# EasyEDA Pro project ax08.eprj, schematic frontpanel_v2
Board Name: frontpanel_v2; Create Date: 2025-09-23; Page Name: frontpanel_v2; Project Name: ax08; Schematic Name: frontpanel_v2; Update Date: 2025-09-24; Company: EasyEDA.com; Page Size: A4; Version: V1.0
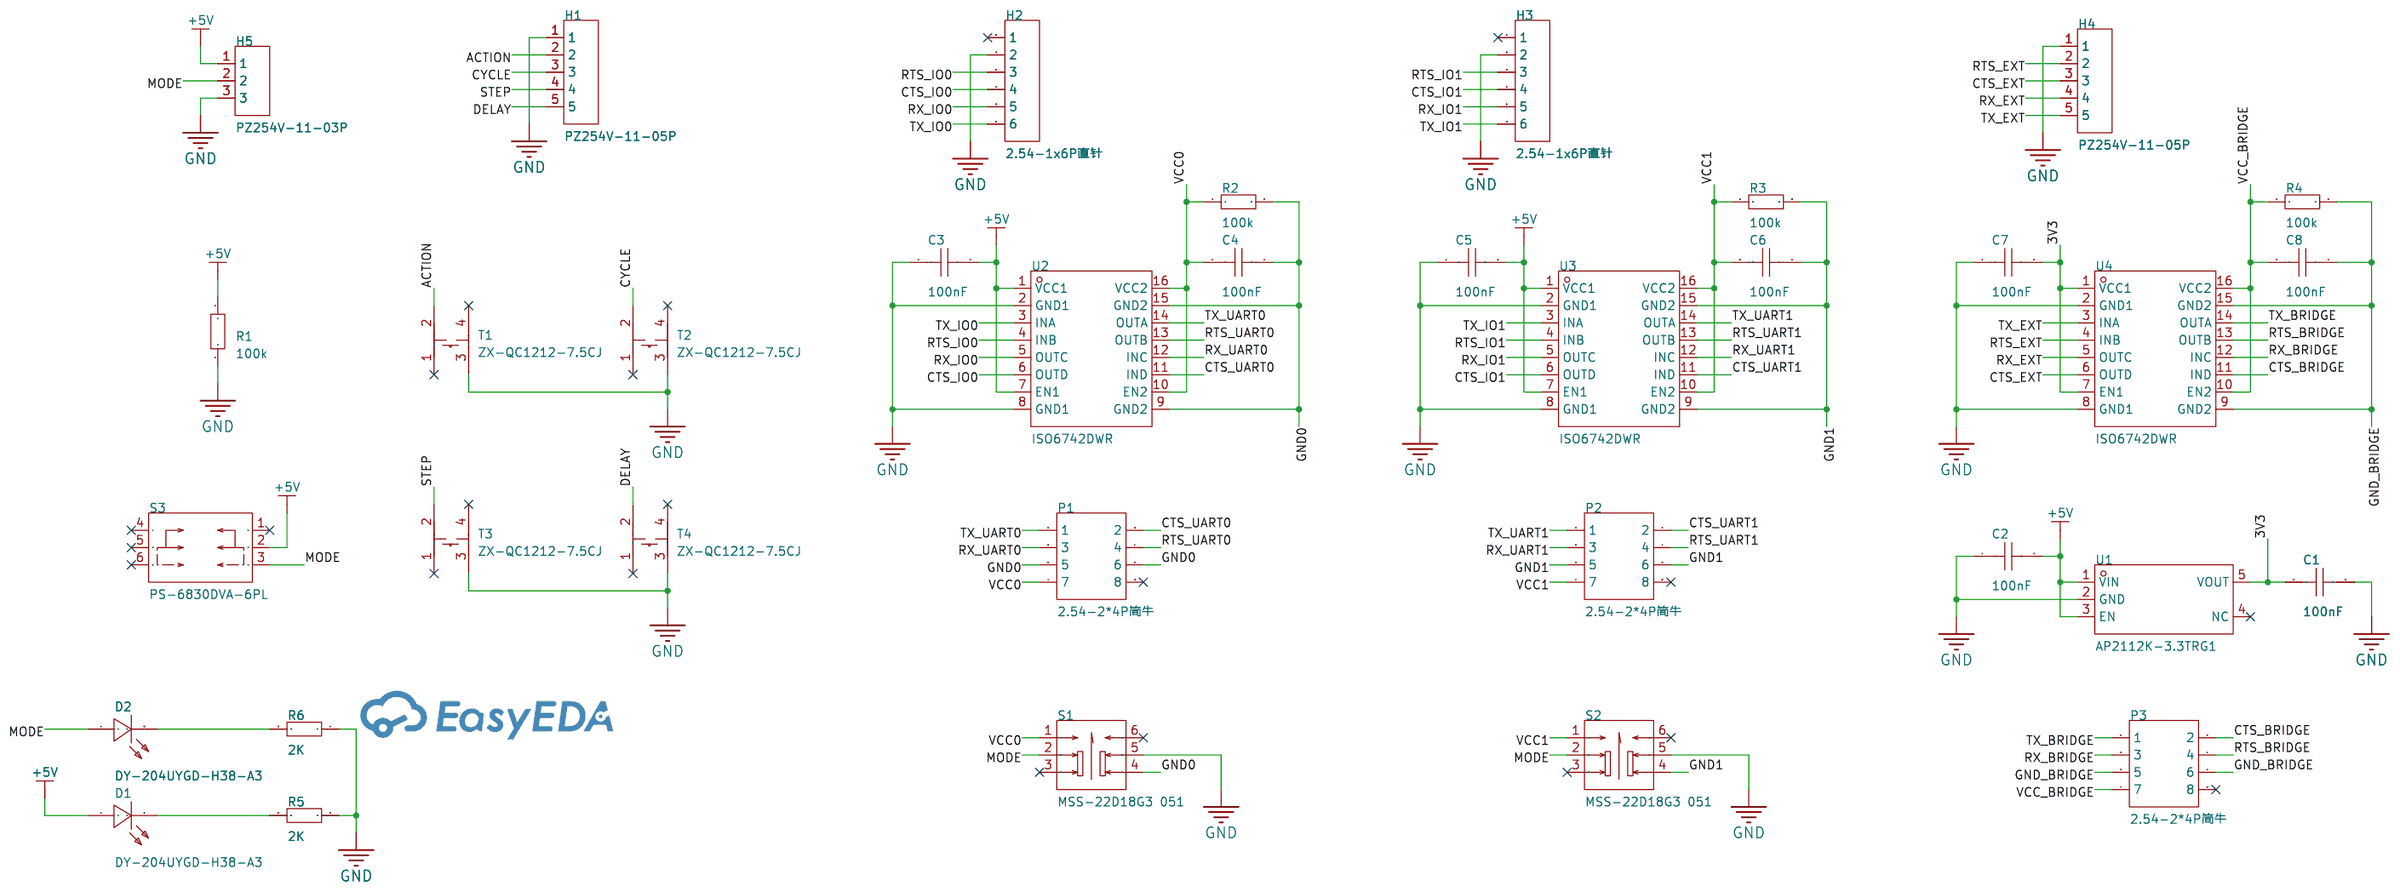
[diagram p38: schematic sheet]

## Parts
C1  100nF  [C0805]
C2  100nF  [C0805]
C3  100nF  [C0805]
C4  100nF  [C0805]
C5  100nF  [C0805]
C6  100nF  [C0805]
C7  100nF  [C0805]
C8  100nF  [C0805]
D1  DY-204UYGD-H38-A3  [LED-TH_BD4.0-P2.54-FD]
D2  DY-204UYGD-H38-A3  [LED-TH_BD4.0-P2.54-FD]
H1  PZ254V-11-05P  [HDR-TH_5P-P2.54-V-M]
H2  2.54-1x6P直针  [HDR-TH_6P-P2.54-V-M-1]
H3  2.54-1x6P直针  [HDR-TH_6P-P2.54-V-M-1]
H4  PZ254V-11-05P  [HDR-TH_5P-P2.54-V-M]
H5  PZ254V-11-03P  [HDR-TH_3P-P2.54-V-M]
P1  2.54-2*4P简牛  [IDC-TH_8P-P2.54-V-R2-C4-S2.54]
P2  2.54-2*4P简牛  [IDC-TH_8P-P2.54-V-R2-C4-S2.54]
P3  2.54-2*4P简牛  [IDC-TH_8P-P2.54-V-R2-C4-S2.54]
R1  100k  [R0805_1]
R2  100k  [R0805_1]
R3  100k  [R0805_1]
R4  100k  [R0805_1]
R5  2K  [R0805_1]
R6  2K  [R0805_1]
S1  MSS-22D18G3 051  [SW-TH_MSS-22D18G3-051]
S2  MSS-22D18G3 051  [SW-TH_MSS-22D18G3-051]
S3  PS-6830DVA-6PL  [SW-TH_6P-L6.4-W6.4-P2.00-LS4.5_PS-6830DVA-6PN]
T1  ZX-QC1212-7.5CJ  [KEY-TH_4P-L12.0-W12.0-P5.00-LS12.5]
T2  ZX-QC1212-7.5CJ  [KEY-TH_4P-L12.0-W12.0-P5.00-LS12.5]
T3  ZX-QC1212-7.5CJ  [KEY-TH_4P-L12.0-W12.0-P5.00-LS12.5]
T4  ZX-QC1212-7.5CJ  [KEY-TH_4P-L12.0-W12.0-P5.00-LS12.5]
U1  AP2112K-3.3TRG1  [SOT-25-5_L2.9-W1.6-P0.95-LS2.8-BL]
U2  ISO6742DWR  [SOIC-16_L10.3-W7.4-P1.27-LS10.3-BL]
U3  ISO6742DWR  [SOIC-16_L10.3-W7.4-P1.27-LS10.3-BL]
U4  ISO6742DWR  [SOIC-16_L10.3-W7.4-P1.27-LS10.3-BL]

## Library data of the parts
C1-C8 = CC0805KRX7R9BB104: Capacitance: Tolerance:±10% Tolerance:±10% Voltage Rated: Temperature Coefficient:; LCSC Part Name: 100nF ±10% 50V; Supplier Part: C49678; Manufacturer: YAGEO(国巨); Supplier Footprint: 0805; JLCPCB Part Class: Basic Part; Datasheet: https://atta.szlcsc.com/upload/public/pdf/source/20180224/C181747_15194369449651363981.pdf; Supplier: LCSC; Tolerance: ±10%
D1 D2 = DY-204UYGD-H38-A3: LCSC Part Name: 3mm圆头有边黄绿色; Supplier Part: C7470727; Manufacturer: TONYU(东裕); Supplier Footprint: D=3mm; JLCPCB Part Class: Extended Part; Datasheet: https://atta.szlcsc.com/upload/public/pdf/source/20230726/000EB079CD0A8C169FA94F7B667CD1E2.pdf; Supplier: LCSC
H1 H4 = PZ254V-11-05P: LCSC Part Name: 1x5P 间距:2.54mm 方针 直插; Supplier Part: C492404; Manufacturer: XFCN(兴飞); Supplier Footprint: 插件,P=2.54mm; JLCPCB Part Class: Extended Part; Datasheet: https://atta.szlcsc.com/upload/public/pdf/source/20200309/C492404_E51533260F8710EFF5D4617281164C1D.pdf; Supplier: LCSC; Pin Structure: 1x5P; Pitch: 2.54mm; Circluar Pins/Square Pins: Policy; Mounting Type: Straight; Number of Rows: Single Row; Number of Pins: 5P; Length of Mating Pin: 6mm; Insulation Height: 2.5mm; Length of End Connection Pin: 3mm; Contact Material: Brass; Operating Temperature: -40℃~+105℃; Color: Black
H2 H3 = 2.54-1x6P直针: LCSC Part Name: 1x6P 间距:2.54mm 方针 直插; Supplier Part: C37208; Manufacturer: BOOMELE(博穆精密); Supplier Footprint: 插件,P=2.54mm; JLCPCB Part Class: Extended Part; Datasheet: https://atta.szlcsc.com/upload/public/pdf/source/20250115/42A019761A40C8B839643401D8CA5A96.pdf; Supplier: LCSC; Pin Structure: 1x6P; Pitch: 2.54mm; Circluar Pins/Square Pins: Policy; Mounting Type: Straight; Number of Rows: Single Row; Number of Pins: 6P; Current Rating: 3A; Contact Material: Brass; Operating Temperature: -40℃~+105℃; Color: Black
H5 = PZ254V-11-03P: LCSC Part Name: 1x3P 间距:2.54mm 方针 直插; Supplier Part: C2937625; Manufacturer: XFCN(兴飞); Supplier Footprint: 插件,P=2.54mm; JLCPCB Part Class: Extended Part; Datasheet: https://atta.szlcsc.com/upload/public/pdf/source/20200309/C492402_8335C3D49C4E4C618838D59BB1D024C1.pdf; Supplier: LCSC; Pin Structure: 1x3P; Pitch: 2.54mm; Circluar Pins/Square Pins: Policy; Mounting Type: Straight; Number of Rows: Single Row; Number of Pins: 3P; Current Rating: 3A; Voltage Rating (Max): 250V; Length of Mating Pin: 6mm; Insulation Height: 2.5mm; Length of End Connection Pin: 3mm; Operating Temperature: -40℃~+105℃; Color: Black
P1-P3 = 2.54-2*4P简牛: LCSC Part Name: 2.54mm 2x4P 排数:2 每排P数:4; Supplier Part: C9135; Manufacturer: BOOMELE(博穆精密); Supplier Footprint: 插件,P=2.54mm; JLCPCB Part Class: Extended Part; Datasheet: https://item.szlcsc.com/datasheet/2.54-2*4P%25E7%25AE%2580%25E7%2589%259B/9658.html; Supplier: LCSC; Connector Type: IDC Header; Pitch: 2.54mm; Number of Positions or Pins: 2x4P; Holder Type: Through Hole; Row Spacing: 2.54mm; Number of Rows: 2; Number of PINs Per Row: 4
R1-R6 = Res_0603: Supplier Footprint: 0603
S1 S2 = MSS-22D18G3 051: LCSC Part Name: 两档立式插件 6脚拨动 柄长3MM; Supplier Part: C7507430; Manufacturer: SHOU HAN(首韩); Supplier Footprint: DIP; JLCPCB Part Class: Extended Part; Datasheet: https://item.szlcsc.com/datasheet/MSS-22D18G3%2520051/8598452.html; Supplier: LCSC; Circuit: DPDT; Actuator Style: Rectangular Columnar; Termination Style: PC Pin; Mounting Type: Through Hole; Current Rating: 100mA; Voltage Rating: 12V; Life: 10,000 Cycles; Operating Temperature: -10℃~+50℃
S3 = PS-6830DVA-6PL: LCSC Part Name: 平头自锁,行程1.0mm,按动力180gf,带防水帽,IP65; Supplier Part: C5155620; Manufacturer: G-Switch(品赞); Supplier Footprint: 插件; JLCPCB Part Class: Extended Part; Datasheet: https://item.szlcsc.com/datasheet/PS-6830DVA-6PL/5785373.html; Supplier: LCSC; Self Lock / No Lock: Latching; Actuator Style: Rectangular Plunger; Contact Current: 500mA; Voltage Rating: 24V; Actuator/Cap Color: White; With Lamp: Without; Operating Force: 1.8N; Operating Temperature: -40℃~+85℃; Life: 30,000 Cycles
T1-T4 = ZX-QC1212-7.5CJ: LCSC Part Name: 12*12*7.5插件; Supplier Part: C7470190; Manufacturer: Megastar(兆星); Supplier Footprint: DIP; JLCPCB Part Class: Extended Part; Datasheet: https://atta.szlcsc.com/upload/public/pdf/source/20230724/4B47FF3F78A9A93D44388AE7A727BAE5.pdf; Supplier: LCSC; Circuit: SPST; Actuator Style: Round Button; Operating Force: 260gf; Mounting Style: Direct Insert; Switch Length: 12mm; Switch Width: 12mm; Switch Height: 7.5mm; Strike Gundam: Without bracket; Contact Current: 50mA; Voltage Rating: 12V; Actuator/Cap Color: Black; Pin Style: PCPin; Mechanical Life: 100000 Times; Operating Temperature: -30℃~+80℃
U1 = AP2112K-3.3TRG1: LCSC Part Name: 输入6V 输出3.3V 600mA; Supplier Part: C51118; Manufacturer: DIODES(美台); Supplier Footprint: SOT-25-5; JLCPCB Part Class: Extended Part; Datasheet: https://item.szlcsc.com/datasheet/AP2112K-3.3TRG1/52131.html; Supplier: LCSC; Output Type: Fixed; Voltage - Supply: 6V; Output Voltage: 3.3V; Output Current: 600mA; Power Supply Rejection Ratio (PSRR): 65dB@(1kHz); Voltage Dropout: 250mV@(600mA); standby current: 55uA; Noise: 50uVrms; Features: Enable；Over Temperature Protection；Over Current Protection; Operating Temperature: -40℃~+85℃@(Ta); Output Configuration: Positive; Number of Outputs: 1
U2-U4 = ISO6742DWR_C5216407: LCSC Part Name: 通用四通道 2/2 数字隔离器; Supplier Part: C5216407; Manufacturer: TI(德州仪器); Supplier Footprint: SOIC-16-300mil; JLCPCB Part Class: Extended Part; Datasheet: https://www.ti.com/cn/lit/gpn/iso6742; Supplier: LCSC; Number of Forward Channels: 2; Number of Reverse Channels: 2; Data Rate(Max): 50Mbps; Isolation Voltage(Vrms): 5000; Operating Temperature: -40℃~+125℃

## Nets
3V3: C1.1 C7.2 U1.5(VOUT) U4.1(VCC1) U4.7(EN1)
+5V: C2.2 C3.2 C5.2 D1.1(A) H5.1 R1.1 S3.2 U1.1(VIN) U1.3(EN) U2.1(VCC1) U2.7(EN1) U3.1(VCC1) U3.7(EN1)
GND: C1.2 C2.1 C3.1 C5.1 C7.1 H1.1 H2.2 H3.2 H4.1 H5.3 R1.2 R5.1 R6.1 S1.5 S2.5 T1.3 T2.3 T3.3 T4.3 U1.2(GND) U2.2(GND1) U2.8(GND1) U3.2(GND1) U3.8(GND1) U4.2(GND1) U4.8(GND1)
GND0: C4.1 P1.5 P1.6 R2.2 S1.4 U2.9(GND2) U2.15(GND2)
GND1: C6.1 P2.5 P2.6 R3.2 S2.4 U3.9(GND2) U3.15(GND2)
GND_BRIDGE: C8.1 P3.5 P3.6 R4.2 U4.9(GND2) U4.15(GND2)
VCC0: C4.2 P1.7 R2.1 S1.1 U2.10(EN2) U2.16(VCC2)
VCC1: C6.2 P2.7 R3.1 S2.1 U3.10(EN2) U3.16(VCC2)
VCC_BRIDGE: C8.2 P3.7 R4.1 U4.10(EN2) U4.16(VCC2)
ACTION: H1.2 T1.2
CTS_BRIDGE: P3.2 U4.11(IND)
CTS_EXT: H4.3 U4.6(OUTD)
CTS_IO0: H2.4 U2.6(OUTD)
CTS_IO1: H3.4 U3.6(OUTD)
CTS_UART0: P1.2 U2.11(IND)
CTS_UART1: P2.2 U3.11(IND)
CYCLE: H1.3 T2.2
DELAY: H1.5 T4.2
MODE: D2.1(A) H5.2 S1.2 S2.2 S3.3
RTS_BRIDGE: P3.4 U4.13(OUTB)
RTS_EXT: H4.2 U4.4(INB)
RTS_IO0: H2.3 U2.4(INB)
RTS_IO1: H3.3 U3.4(INB)
RTS_UART0: P1.4 U2.13(OUTB)
RTS_UART1: P2.4 U3.13(OUTB)
RX_BRIDGE: P3.3 U4.12(INC)
RX_EXT: H4.4 U4.5(OUTC)
RX_IO0: H2.5 U2.5(OUTC)
RX_IO1: H3.5 U3.5(OUTC)
RX_UART0: P1.3 U2.12(INC)
RX_UART1: P2.3 U3.12(INC)
STEP: H1.4 T3.2
TX_BRIDGE: P3.1 U4.14(OUTA)
TX_EXT: H4.5 U4.3(INA)
TX_IO0: H2.6 U2.3(INA)
TX_IO1: H3.6 U3.3(INA)
TX_UART0: P1.1 U2.14(OUTA)
TX_UART1: P2.1 U3.14(OUTA)
$1N9870: D1.2(K) R5.2
$1N9871: D2.2(K) R6.2

Not connected (* = marked no-connect by the designer): H2 1*; H3 1*; P1 8*; P2 8*; P3 8*; S1 3* 6*; S2 3* 6*; S3 1* 4* 5* 6*; T1 1* 4*; T2 1* 4*; T3 1* 4*; T4 1* 4*; U1 4(NC)*
